# EAGLE schematic rbccpsiisc_nRF24Cheep (EAGLE 7.3.0)
CNAME: NRF24l01+ based Beacon Board; CREVISION: REV2.4; DESIGNER: Gurinder, Prithvi
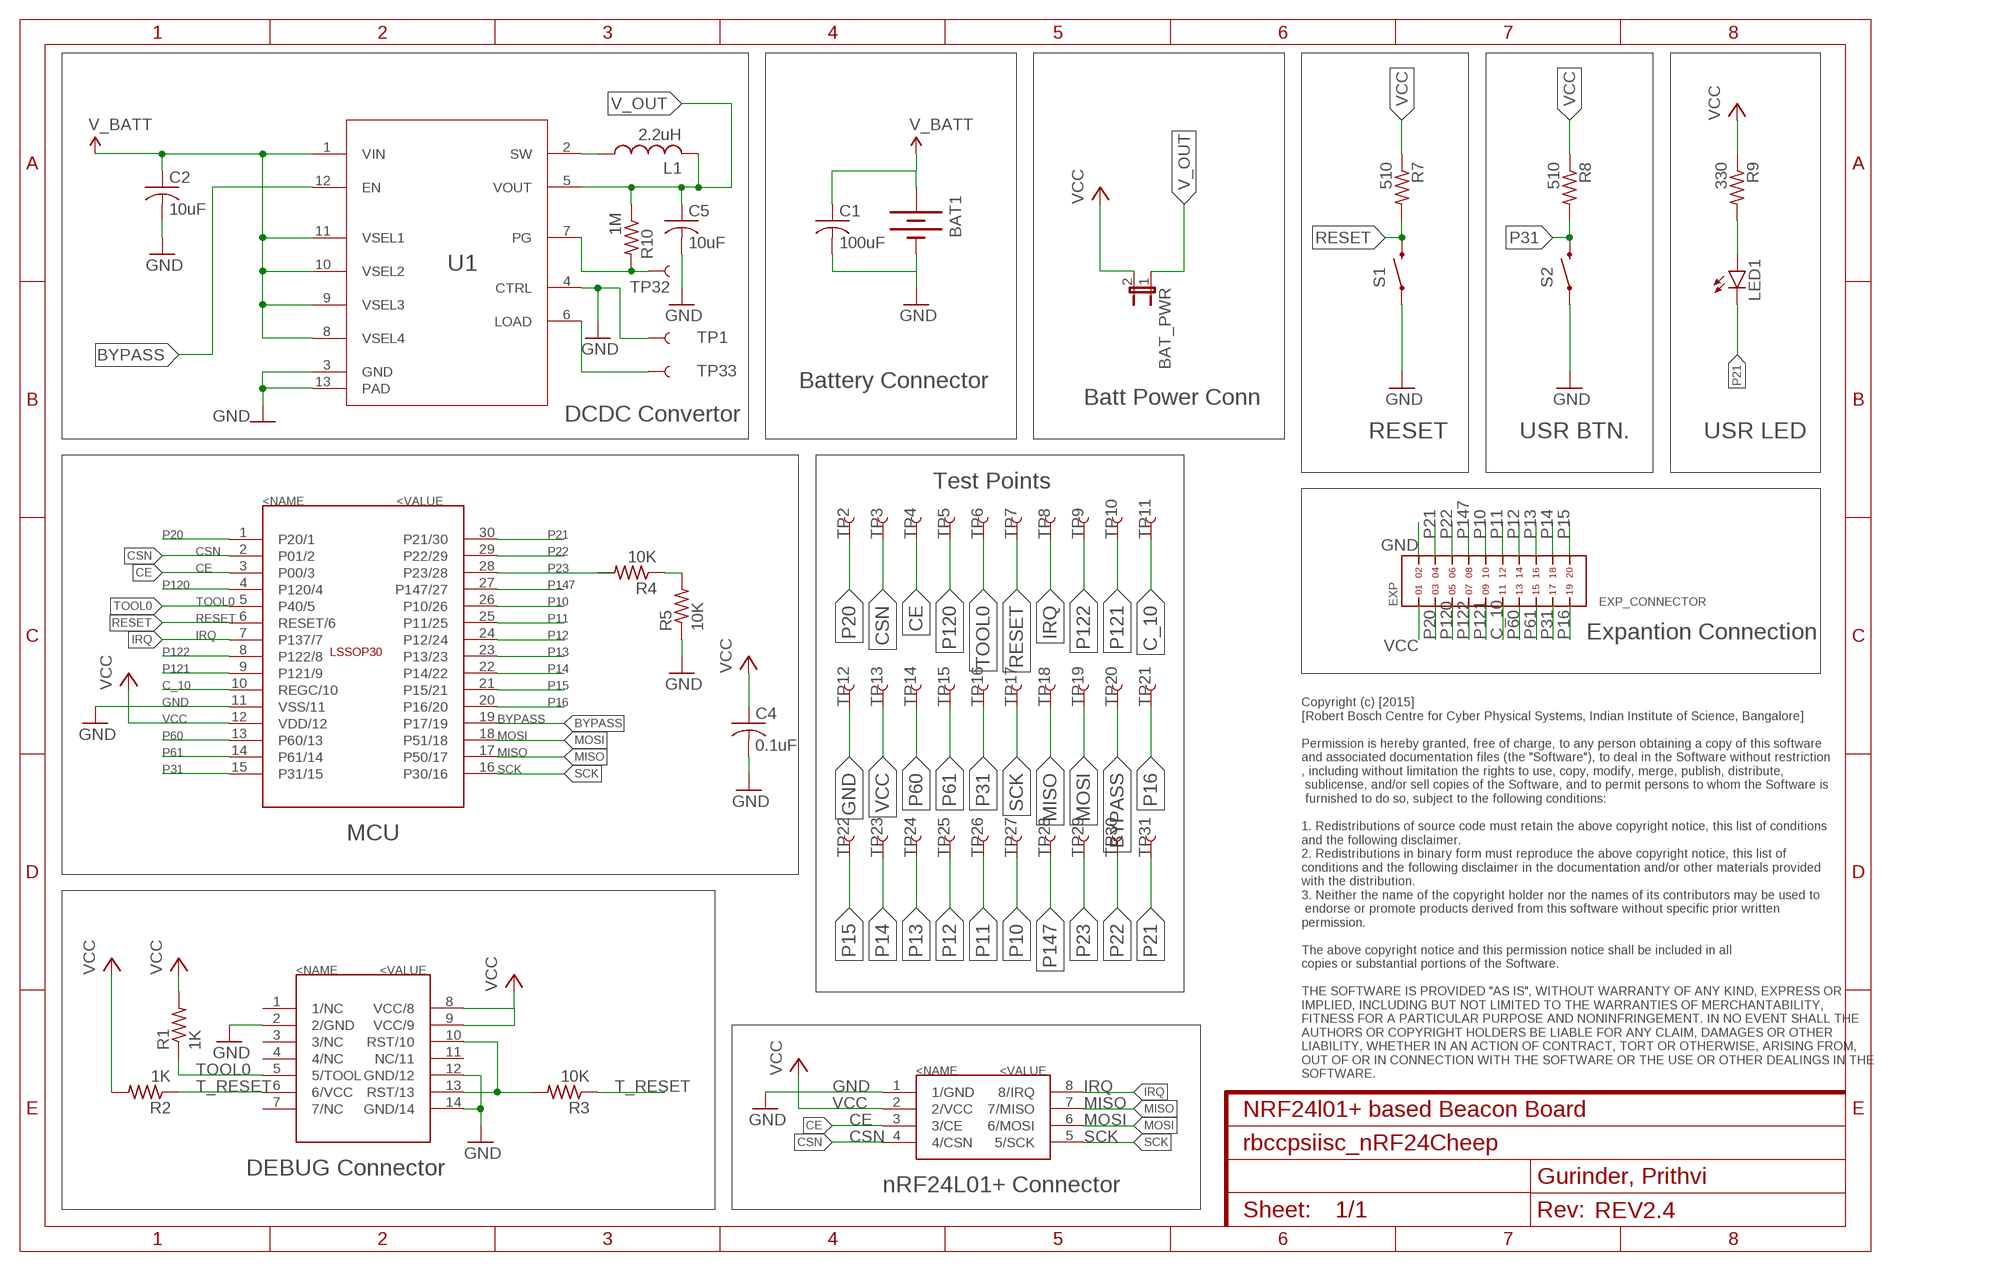
[diagram p0: schematic, sheet 1]

## Parts
BAT1  BATTERY20SMD  [BATTCON_20MM]
BAT_PWR  JUMPER-2PTH  [1X02]
C1  100uF  C-USC1206K  [C1206K]
C2  10uF  C-USC0603K  [C0603K]
C4  0.1uF  C-USC0603K  [C0603K]
C5  10uF  C-USC0603K  [C0603K]
EXP  EXP_CONNECTOR  2X10  [2X10]
L1  2.2uH  L-USL2012C  [L2012C]
LED1  LED0603  [LED-0603]
NRFSOCKET  BERG_NRF24_NRF24  [BERG_NRF24_NRF24]
R1  1K  R-US_R0603  [R0603]
R2  1K  R-US_R0603  [R0603]
R3  10K  R-US_R0603  [R0603]
R4  10K  R-US_R0603  [R0603]
R5  10K  R-US_R0603  [R0603]
R7  510  R-US_R0603  [R0603]
R8  510  R-US_R0603  [R0603]
R9  330  R-US_R0603  [R0603]
R10  1M  R-US_R0603  [R0603]
RENASENCE  SSOP30_SSOP30  [SSOP30_SSOP30]
S1  SWITCH-MOMENTARY-2-SMD-1101NE  [TACTILE-SWITCH-1101NE]
S2  SWITCH-MOMENTARY-2-SMD-1101NE  [TACTILE-SWITCH-1101NE]
TP1  TEST-POINT3X4  [PAD.03X.04]
TP2  TEST-POINT3X4  [PAD.03X.04]
TP3  TEST-POINT3X4  [PAD.03X.04]
TP4  TEST-POINT3X4  [PAD.03X.04]
TP5  TEST-POINT3X4  [PAD.03X.04]
TP6  TEST-POINT3X4  [PAD.03X.04]
TP7  TEST-POINT3X4  [PAD.03X.04]
TP8  TEST-POINT3X4  [PAD.03X.04]
TP9  TEST-POINT3X4  [PAD.03X.04]
TP10  TEST-POINT3X4  [PAD.03X.04]
TP11  TEST-POINT3X4  [PAD.03X.04]
TP12  TEST-POINT3X4  [PAD.03X.04]
TP13  TEST-POINT3X4  [PAD.03X.04]
TP14  TEST-POINT3X4  [PAD.03X.04]
TP15  TEST-POINT3X4  [PAD.03X.04]
TP16  TEST-POINT3X4  [PAD.03X.04]
TP17  TEST-POINT3X4  [PAD.03X.04]
TP18  TEST-POINT3X4  [PAD.03X.04]
TP19  TEST-POINT3X4  [PAD.03X.04]
TP20  TEST-POINT3X4  [PAD.03X.04]
TP21  TEST-POINT3X4  [PAD.03X.04]
TP22  TEST-POINT3X4  [PAD.03X.04]
TP23  TEST-POINT3X4  [PAD.03X.04]
TP24  TEST-POINT3X4  [PAD.03X.04]
TP25  TEST-POINT3X4  [PAD.03X.04]
TP26  TEST-POINT3X4  [PAD.03X.04]
TP27  TEST-POINT3X4  [PAD.03X.04]
TP28  TEST-POINT3X4  [PAD.03X.04]
TP29  TEST-POINT3X4  [PAD.03X.04]
TP30  TEST-POINT3X4  [PAD.03X.04]
TP31  TEST-POINT3X4  [PAD.03X.04]
TP32  TEST-POINT3X4  [PAD.03X.04]
TP33  TEST-POINT3X4  [PAD.03X.04]
U1  TPS62740DSST  [DSS0012A]
U$3  BERG_5_BERG_14  [BERG_5_BERG_5]

## Nets
BYPASS: RENASENCE.19(P17/19) TP20.P$1 U1.12(EN)
C_10: EXP.11 RENASENCE.10(REGC/10) TP11.P$1
CE: NRFSOCKET.3(3/CE) RENASENCE.3(P00/3) TP4.P$1
CSN: NRFSOCKET.4(4/CSN) RENASENCE.2(P01/2) TP3.P$1
GND [power]: BAT1.2(-) C1.2 C2.2 C4.2 C5.2 EXP.2 NRFSOCKET.1(1/GND) R5.1 RENASENCE.11(VSS/11) S1.P$1 S2.P$1 TP1.P$1 TP12.P$1 U1.3(GND) U1.4(CTRL) U1.13(PAD) U$3.2(2/GND) U$3.12(GND/12) U$3.14(GND/14)
IRQ: NRFSOCKET.8(8/IRQ) RENASENCE.7(P137/7) TP8.P$1
MISO: NRFSOCKET.7(7/MISO) RENASENCE.17(P50/17) TP18.P$1
MOSI: NRFSOCKET.6(6/MOSI) RENASENCE.18(P51/18) TP19.P$1
N$2: LED1.A R9.2
N$4: TP33.P$1 U1.6(LOAD)
N$5: L1.1 U1.2(SW)
N$6: R10.2 TP32.P$1 U1.7(PG)
N$31: R4.1 R5.2
P10: EXP.10 RENASENCE.26(P10/26) TP27.P$1
P11: EXP.12 RENASENCE.25(P11/25) TP26.P$1
P12: EXP.14 RENASENCE.24(P12/24) TP25.P$1
P13: EXP.16 RENASENCE.23(P13/23) TP24.P$1
P14: EXP.18 RENASENCE.22(P14/22) TP23.P$1
P15: EXP.20 RENASENCE.21(P15/21) TP22.P$1
P16: EXP.19 RENASENCE.20(P16/20) TP21.P$1
P20: EXP.3 RENASENCE.1(P20/1) TP2.P$1
P21: EXP.4 LED1.C RENASENCE.30(P21/30) TP31.P$1
P22: EXP.6 RENASENCE.29(P22/29) TP30.P$1
P23: R4.2 RENASENCE.28(P23/28) TP29.P$1
P31: EXP.17 R8.2 RENASENCE.15(P31/15) S2.P$2 TP16.P$1
P60: EXP.13 RENASENCE.13(P60/13) TP14.P$1
P61: EXP.15 RENASENCE.14(P61/14) TP15.P$1
P120: EXP.5 RENASENCE.4(P120/4) TP5.P$1
P121: EXP.9 RENASENCE.9(P121/9) TP10.P$1
P122: EXP.7 RENASENCE.8(P122/8) TP9.P$1
P147: EXP.8 RENASENCE.27(P147/27) TP28.P$1
RESET: R3.2 R7.2 RENASENCE.6(RESET/6) S1.P$2 TP7.P$1 U$3.10(RST/10) U$3.13(RST/13)
SCK: NRFSOCKET.5(5/SCK) RENASENCE.16(P30/16) TP17.P$1
T_RESET: R2.1 R3.1 U$3.6(6/VCC)
TOOL0: R1.1 RENASENCE.5(P40/5) TP6.P$1 U$3.5(5/TOOL)
V_BATT: BAT1.1(+) C1.1 C2.1 U1.1(VIN) U1.8(VSEL4) U1.9(VSEL3) U1.10(VSEL2) U1.11(VSEL1)
V_OUT: BAT_PWR.1 C5.1 L1.2 R10.1 U1.5(VOUT)
VCC: BAT_PWR.2 C4.1 EXP.1 NRFSOCKET.2(2/VCC) R1.2 R2.2 R7.1 R8.1 R9.1 RENASENCE.12(VDD/12) TP13.P$1 U$3.8(VCC/8) U$3.9(VCC/9)
Unconnected: U$3.1(1/NC) U$3.3(3/NC) U$3.4(4/NC) U$3.7(7/NC) U$3.11(NC/11)

## Notes on the sheet
- Battery Connector
- Batt Power Conn
- DCDC Convertor
- RESET | USR BTN. | USR LED
- Test Points
- Expantion Connection
- MCU
- Copyright (c) [2015] 
  [Robert Bosch Centre for Cyber Physical Systems, Indian Institute of Science, Bangalore]
   
  Permission is hereby granted, free of charge, to any person obtaining a copy of this software 
  and associated documentation files (the "Software"), to deal in the Software without restriction
  , including without limitation the rights to use, copy, modify, merge, publish, distribute,
   sublicense, and/or sell copies of the Software, and to permit persons to whom the Software is
   furnished to do so, subject to the following conditions:
   
  1. Redistributions of source code must retain the above copyright notice, this list of conditions 
  and the following disclaimer.
  2. Redistributions in binary form must reproduce the above copyright notice, this list of 
  conditions and the following disclaimer in the documentation and/or other materials provided 
  with the distribution.
  3. Neither the name of the copyright holder nor the names of its contributors may be used to
   endorse or promote products derived from this software without specific prior written 
  permission.
   
  The above copyright notice and this permission notice shall be included in all
  copies or substantial portions of the Software.
   
  THE SOFTWARE IS PROVIDED "AS IS", WITHOUT WARRANTY OF ANY KIND, EXPRESS OR
  IMPLIED, INCLUDING BUT NOT LIMITED TO THE WARRANTIES OF MERCHANTABILITY,
  FITNESS FOR A PARTICULAR PURPOSE AND NONINFRINGEMENT. IN NO EVENT SHALL THE
  AUTHORS OR COPYRIGHT HOLDERS BE LIABLE FOR ANY CLAIM, DAMAGES OR OTHER
  LIABILITY, WHETHER IN AN ACTION OF CONTRACT, TORT OR OTHERWISE, ARISING FROM,
  OUT OF OR IN CONNECTION WITH THE SOFTWARE OR THE USE OR OTHER DEALINGS IN THE
  SOFTWARE.
  ​
- DEBUG Connector
- nRF24L01+ Connector

## Library data of the parts
BAT1 = SparkFun-Electromechanical:BATTERY: Battery Holders Various common sizes : AA, AAA, 20mm coin cell and 12mm coin cell. 20MM_4LEGS, BATT-10373
BAT_PWR = SparkFun-Retired:JUMPER-2: Jumper Basic 0.1" spaced jumper. Use with breakaway headers.
C1 C2 C4 C5 = rcl:C-US: CAPACITOR, American symbol
EXP = headers(2mm):2X10
L1 = rcl:L-US: INDUCTOR, American symbol
LED1 = SparkFun-LED:LED: LEDs Standard schematic elements and footprints for 5mm, 3mm, 1206, and 0603 sized LEDs. 5mm - Spark Fun Electronics SKU : COM-00529 (and others)
NRFSOCKET = RBC_CPS_BOARD_REV1:BERG_NRF24_NRF24
R1-R5 R7-R10 = rcl:R-US_: RESISTOR, American symbol
RENASENCE = RBC_CPS_BOARD_REV1:SSOP30_SSOP30
S1 S2 = SparkFun-Electromechanical:SWITCH-MOMENTARY-2: Various NO switches- pushbuttons, reed, etc
TP1-TP33 = SparkFun-Passives:TEST-POINT: Bare copper test points for troubleshooting or ICT
U1 = TPS62740:TPS62740DSST; ADDRESS1: Not shown in title block; ADDRESS2: Not shown in title block; ADDRESS3: Not shown in title block; ADDRESS4: Not shown in title block; ALTERNATEMANUFACTURER: None; APPROVEDBY: Not shown in title block; AUTHOR: Not shown in title block; CHECKEDBY: Not shown in title block; COMPANYNAME: Not shown in title block; COMPONENTLINK1DESCRIPTION: Datasheet Link; COMPONENTLINK1URL: http://www.ti.com/lit/ds/symlink/tps62740.pdf; COMPTYPE: IC; CURRENTDATE: Not shown in title block; CURRENTTIME: Not shown in title block; DATE: Not shown in title block; DESIGNATOR: U?; DOCUMENTFULLPATHANDNAME: Not shown in title block; DOCUMENTNAME: Not shown in title block; DOCUMENTNUMBER: 1; ENGINEER: Not shown in title block; IMAGEPATH: Not shown in title block; LATESTREVISIONDATE: 2014-02-11; MANUFACTURER: Texas Instruments; MODIFIEDDATE: Not shown in title block; MOUNTTYPE: SMT; ORGANIZATION: Not shown in title block; PACKAGEREFERENCE: DSS0012A; PARTNUMBER: TPS62740DSS; PIN_COUNT: 13; PROJECTNAME: *; PUBLISHER: Texas Instruments; REVISION: Use project parameter SCH_Rev; ROHS: Y; RULE: *; SHEETNUMBER: 1; SHEETTOTAL: 1; SYMBOLCREATOR: a0411947; SYMBOLVERSION: 2014-02-03; TIME: Not shown in title block
U$3 = RBC_CPS_BOARD_REV1:BERG_5_BERG_14

## Net classes
0 track: width 0.203 mm, drill 0.508 mm, clearance 0.203 mm
1 power: width 0.305 mm, drill 0.508 mm, clearance 0.203 mm to class 0, clearance 0.203 mm